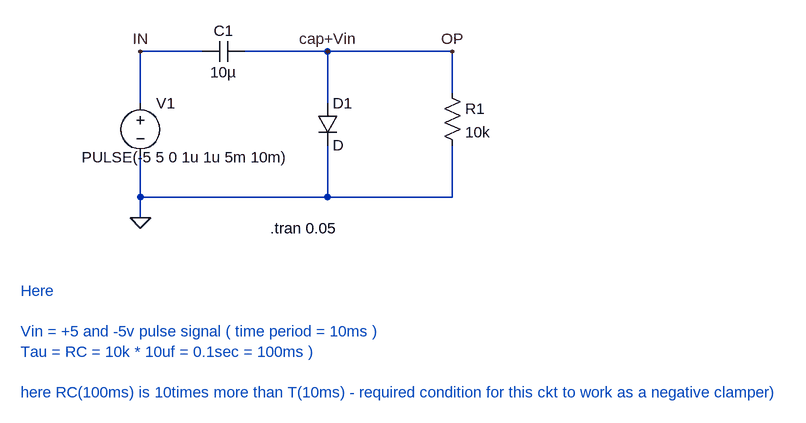
[diagram p0: schematic Clamper_negative_circuit_without_bias_with_pulse_input.asc]
Clamper_negative_circuit_without_bias_with_pulse_input.asc, the LTspice schematic file:
Version 4.1
SHEET 1 1132 680
WIRE 128 32 32 32
WIRE 320 32 192 32
WIRE 512 32 320 32
WIRE 512 96 512 32
WIRE 32 112 32 32
WIRE 320 112 320 32
WIRE 32 256 32 192
WIRE 320 256 320 176
WIRE 320 256 32 256
WIRE 512 256 512 176
WIRE 512 256 320 256
WIRE 32 288 32 256
FLAG 32 288 0
FLAG 32 32 IN
FLAG 320 32 cap+Vin
FLAG 512 32 OP
SYMBOL voltage 32 96 R0
WINDOW 3 -90 99 Left 2
WINDOW 123 0 0 Left 0
WINDOW 39 0 0 Left 0
SYMATTR Value PULSE(-5 5 0 1u 1u 5m 10m)
SYMATTR InstName V1
SYMBOL cap 192 16 R90
WINDOW 0 0 32 VBottom 2
WINDOW 3 32 32 VTop 2
SYMATTR InstName C1
SYMATTR Value 10µ
SYMATTR SpiceLine V=25
SYMBOL diode 304 112 R0
SYMATTR InstName D1
SYMBOL res 496 80 R0
SYMATTR InstName R1
SYMATTR Value 10k
TEXT 232 304 Left 2 !.tran 0.05
TEXT -152 400 Left 2 ;Here \n \nVin = +5 and -5v pulse signal ( time period = 10ms )\nTau = RC = 10k * 10uf = 0.1sec = 100ms )\n \nhere RC(100ms) is 10times more than T(10ms) - required condition for this ckt to work as a negative clamper)

The netlist it stands for:
* Clamper_negative_circuit_without_bias_with_pulse_input.asc
V1 IN 0 PULSE(-5 5 0 1u 1u 5m 10m)
C1 OP IN 10µ V=25
D1 OP 0 D
R1 OP 0 10k
.model D D
.lib standard.dio
.tran 0.05
* Here
* Vin = +5 and -5v pulse signal ( time period = 10ms )
* Tau = RC = 10k * 10uf = 0.1sec = 100ms )
* here RC(100ms) is 10times more than T(10ms) - required condition for this ckt to work as a negative clamper)
.backanno
.end

* Results of the author's LTspice run, read from the files saved beside the schematic
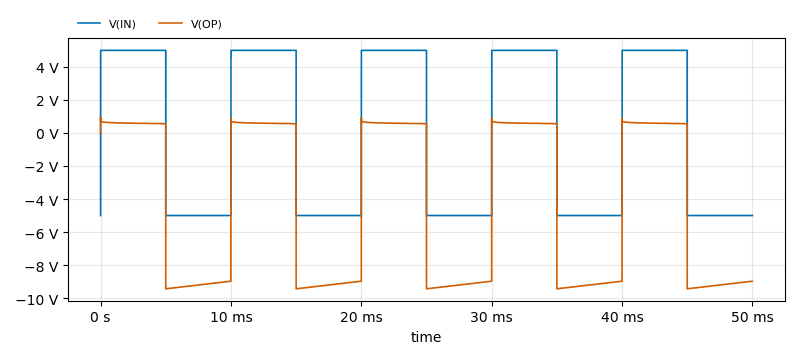
[diagram p1: Transient Analysis of Clamper_negative_circuit_without_bias_with_pulse_input.asc, plotted from the saved traces]
* Transient Analysis, 1 run:
*   V(IN): min -5 V, max 5 V, average 1 mV, rms 5 V, last -5 V
*   V(OP): min -9.437 V, max 954 mV, average -4.305 V, rms 6.526 V, last -8.977 V